# Altium project KN_ATx32.PrjPcb
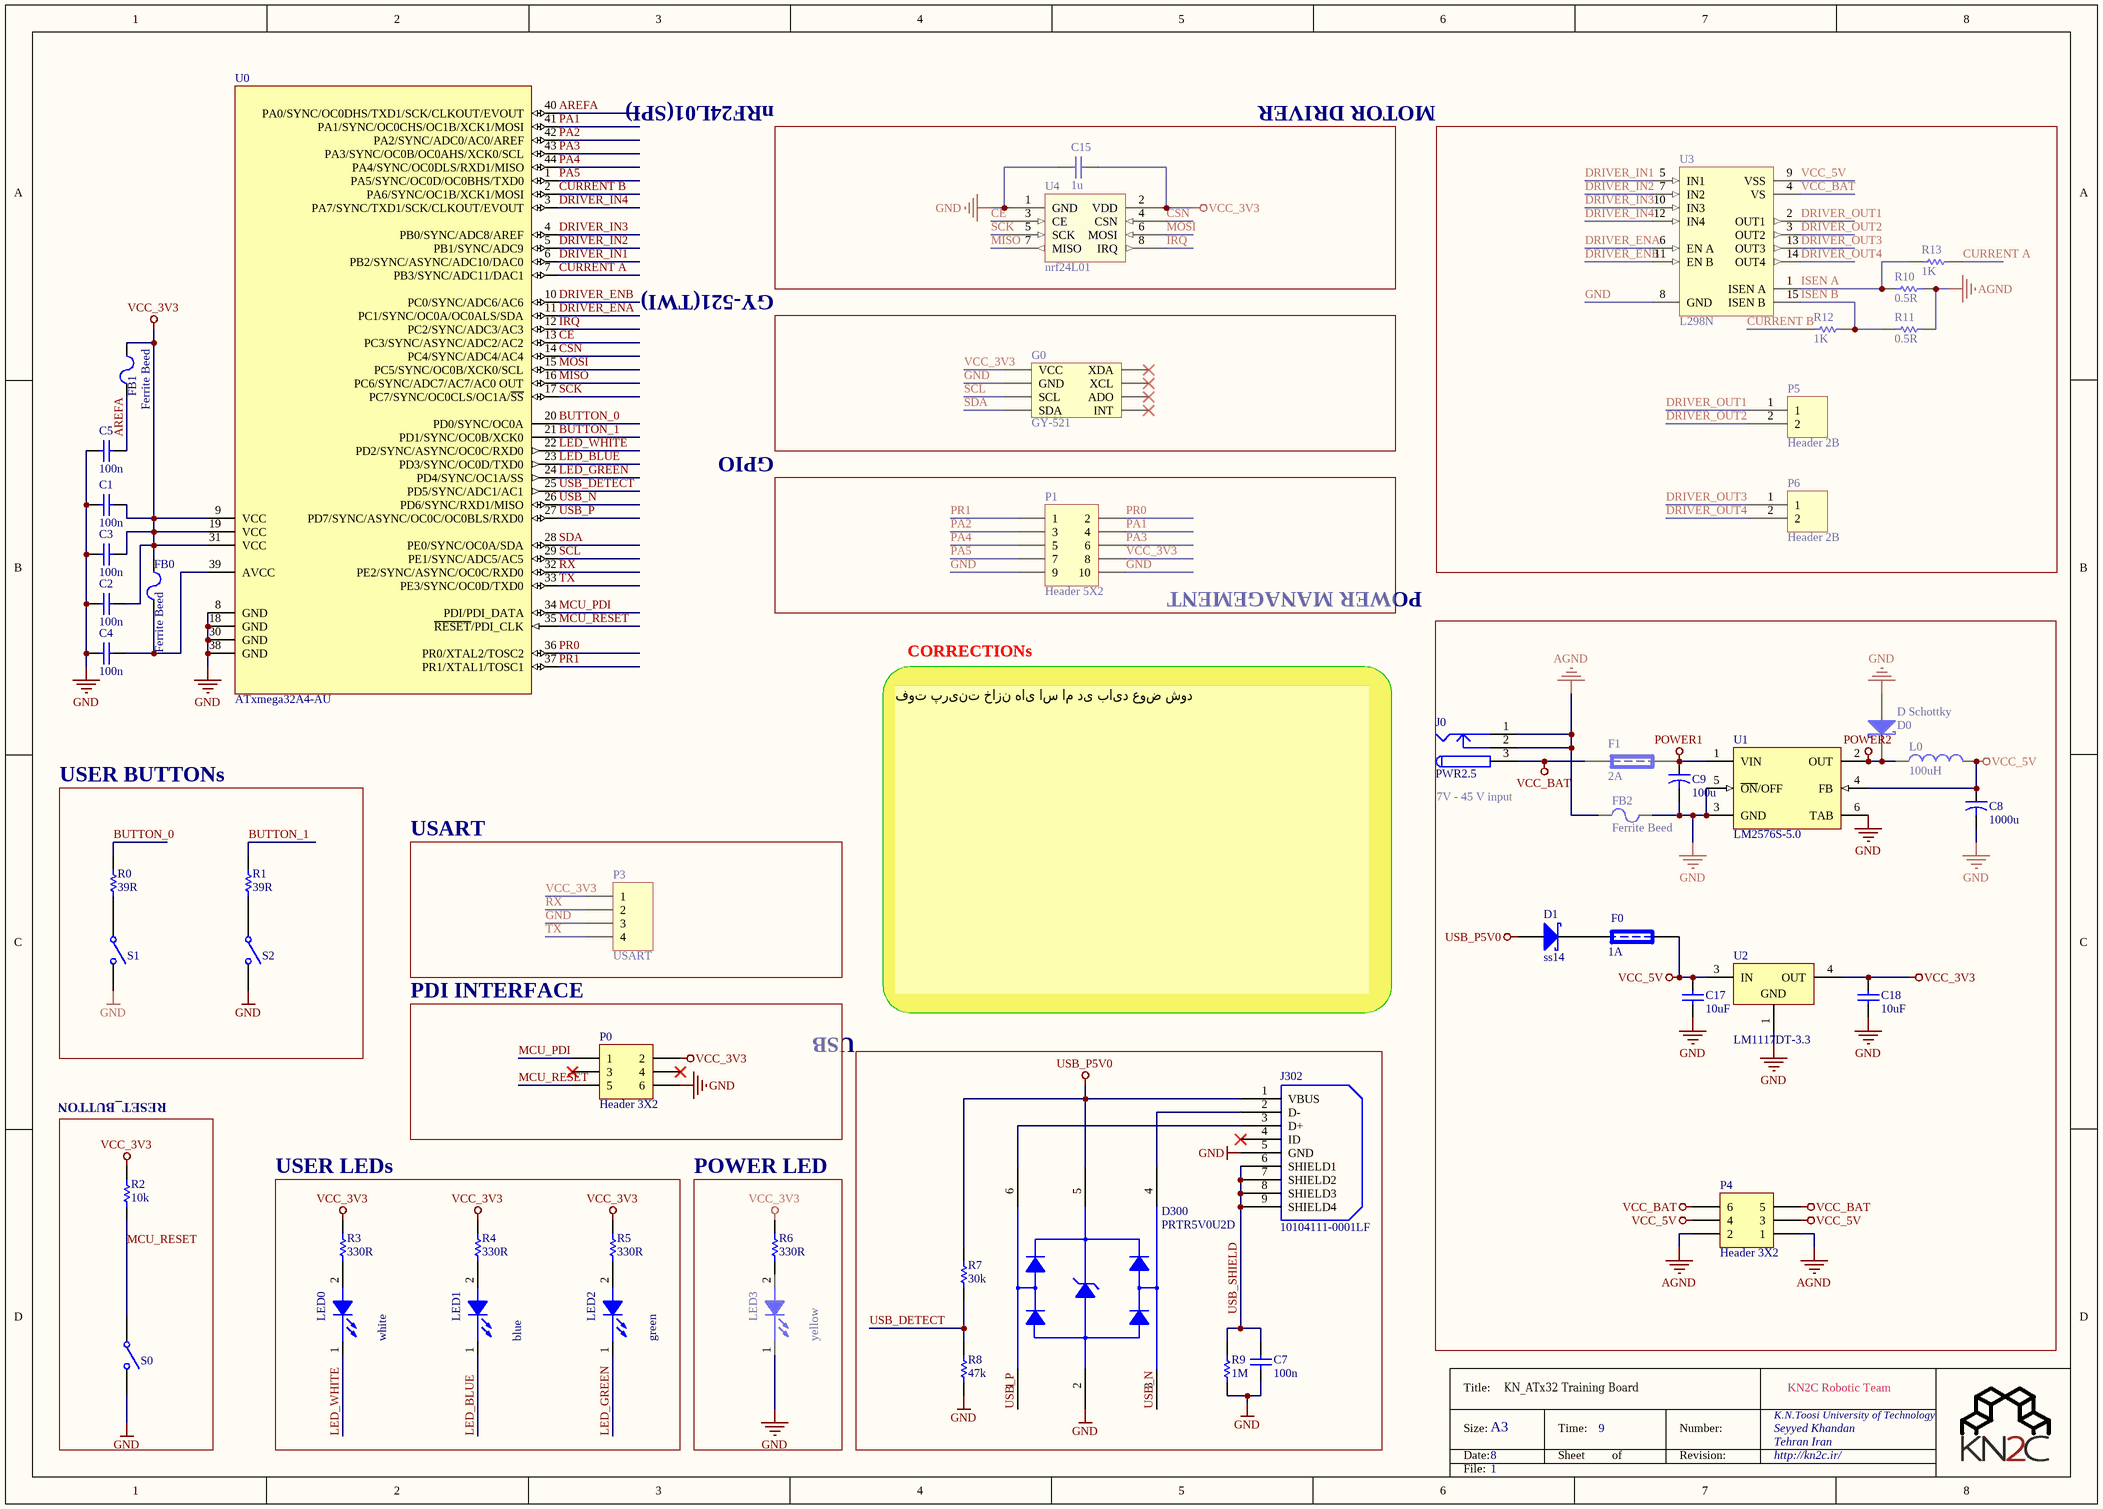
[diagram p0: KN_ATx32.SchDoc]
1 sheet, 55 parts. Net scope: global (net labels, ports and power ports of the same name join across sheets).
Board file: KN_ATx32.PcbDoc

## Sheet KN_ATx32.SchDoc: KN_ATx32 Training ‌Board
size A3; Date: 0; ApprovedBy: 6; CheckedBy: 7; Author: KN2C Robotic Team (M.A.K); CompanyName: KN2C Robotic Team; DrawnBy: 4; Engineer: 5; Organization: 7; Address1: K.N.Toosi University of Technology; Address2: Seyyed Khandan; Address3: Tehran Iran; Address4: http://kn2c.ir/; DocumentNumber: 1; Revision: 1.0; SheetNumber: 1; SheetTotal: 1; CurrentTime: 9; CurrentDate: 8; Time: 8; DocumentFullPathAndName: 1; DocumentName: 2; ModifiedDate: 6; ProjectName: 8; Application_BuildNumber: 5

### Parts
C1  100n  [6-0805_N]
C2  100n  [6-0805_N]
C3  100n  [6-0805_N]
C4  100n  [6-0805_N]
C5  100n  [6-0805_N]
C7  100n  [6-0805_N]
C8  1000u  [AP1-00122]
C9  100u  [AP1-00122]
C15  1u  [6-0805_N]
C17  10uF  [2012[0805]]
C18  10uF  [2012[0805]]
D0  D Schottky  [us1m]
D1  ss14  [US1m]
D300  value PRTR5V0U2D  [SOT457_N]  (hidden comment: PRTR5V0U2X)
F0  1A  [1206]
F1  2A  [1206]
FB0  Ferrite Beed  [2012[0805]]
FB1  Ferrite Beed  [2012[0805]]
FB2  Ferrite Beed  [AXIAL-0.3]
G0  GY-521  [GY-521]
J0  PWR2.5  [CHARGER2]
J302  value 10104111-0001LF  [AP8-00852]  (hidden comment: USB_AB)
L0  100uH  [INDUCTOR_SMD]
LED0  white  [6-0805_N]
LED1  blue  [6-0805_N]
LED2  green  [6-0805_N]
LED3  yellow  [6-0805_N]
P0  Header 3X2  [HDRBOX2X3]
P1  Header 5X2  [HDR2X5]
P3  USART  [HDR1X4]
P4  Header 3X2  [HDR2X3]
P5  Header 2B  [CON2]
P6  Header 2B  [CON2]
R0  39R  [2012[0805]]
R1  39R  [2012[0805]]
R2  10k  [2012[0805]]
R3  330R  [2012[0805]]
R4  330R  [2012[0805]]
R5  330R  [2012[0805]]
R6  330R  [2012[0805]]
R7  30k  [2012[0805]]
R8  47k  [2012[0805]]
R9  1M  [2012[0805]]
R10  0.5R  [6332[2512]]
R11  0.5R  [6332[2512]]
R12  1K  [2012[0805]]
R13  1K  [2012[0805]]
S0  SW-SPST  [pushbutton_smd]  (value not drawn)
S1  SW-SPST  [pushbutton_smd]  (value not drawn)
S2  SW-SPST  [pushbutton_smd]  (value not drawn)
U0  ATxmega32A4-AU  [44A_N]
U1  LM2576S-5.0  [TS5B_N]
U2  LM1117DT-3.3  [SOT223]
U3  L298N  [Multiwatt15V]
U4  nrf24L01  [NRF24L01]

### Blocks framed on the sheet
GY-521(TWI): C15 U4
GPIO: G0
7V - 45 V input: C8 C9 C17 C18 D0 D1 F0 F1 FB2 J0 L0 P4 U1 U2
USER BUTTONs: R0 R1 S1 S2
USART: P3
PDI INTERFACE: P0
USER LEDs: LED0-LED2 R3-R5
POWER LED: LED3 R6

### Nets
AGND: FB2.2 J0.1 J0.2 P4.1 P4.2 R10.2 R11.2
GND: C1.1 C2.1 C3.1 C4.1 C5.1 C7.1 C8.2 C9.2 C15.1 C17.1 C18.1 D0.1(A) D300.2(GND) FB2.1 G0.2(GND) J302.5(GND) LED3.1(CATHODE) P0.6 P1.9 P1.10 P3.3 R8.1 R9.1 S0.2(NO) S1.2(NO) S2.2(NO) U0.8(GND) U0.18(GND) U0.30(GND) U0.38(GND) U1.3(GND) U1.5(~{ON}/OFF) U1.6(TAB) U2.1(GND) U3.8(GND) U4.1(GND)
POWER1: C9.1 F1.2 U1.1(VIN)
POWER2: D0.2(K) L0.1 U1.2(OUT)
USB_P5V0: D1.1(A) D300.5(VCC) J302.1(VBUS) R7.2
VCC_3V3: C1.2 C2.2 C3.2 C15.2 C18.2 FB0.2 FB1.2 G0.1(VCC) P0.2 P1.8 P3.1 R2.2 R3.2 R4.2 R5.2 R6.2 U0.9(VCC) U0.19(VCC) U0.31(VCC) U2.4(OUT) U4.2(VDD)
VCC_5V: C8.1 C17.2 F0.1 L0.2 P4.3 P4.4 U1.4(FB) U2.3(IN) U3.9(VSS)
VCC_BAT: F1.1 J0.3 P4.5 P4.6 U3.4(VS)
AREFA: C5.2 FB1.1 U0.40(PA0/SYNC/OC0DHS/TXD1/SCK/CLKOUT/EVOUT)
BUTTON_0: R0.2 U0.20(PD0/SYNC/OC0A)
BUTTON_1: R1.2 U0.21(PD1/SYNC/OC0B/XCK0)
CE: U0.13(PC3/SYNC/ASYNC/ADC2/AC2) U4.3(CE)
CSN: U0.14(PC4/SYNC/ADC4/AC4) U4.4(CSN)
CURRENT A: R13.2 U0.7(PB3/SYNC/ADC11/DAC1)
CURRENT B: R12.1 U0.2(PA6/SYNC/OC1B/XCK1/MOSI)
DRIVER_ENA: U0.11(PC1/SYNC/OC0A/OC0ALS/SDA) U3.6(EN_A)
DRIVER_ENB: U0.10(PC0/SYNC/ADC6/AC6) U3.11(EN_B)
DRIVER_IN1: U0.6(PB2/SYNC/ASYNC/ADC10/DAC0) U3.5(IN1)
DRIVER_IN2: U0.5(PB1/SYNC/ADC9) U3.7(IN2)
DRIVER_IN3: U0.4(PB0/SYNC/ADC8/AREF) U3.10(IN3)
DRIVER_IN4: U0.3(PA7/SYNC/TXD1/SCK/CLKOUT/EVOUT) U3.12(IN4)
DRIVER_OUT1: P5.1 U3.2(OUT1)
DRIVER_OUT2: P5.2 U3.3(OUT2)
DRIVER_OUT3: P6.1 U3.13(OUT3)
DRIVER_OUT4: P6.2 U3.14(OUT4)
IRQ: U0.12(PC2/SYNC/ADC3/AC3) U4.8(IRQ)
ISEN A: R10.1 R13.1 U3.1(ISEN_A)
ISEN B: R11.1 R12.2 U3.15(ISEN_B)
LED_BLUE: LED1.1(CATHODE) U0.23(PD3/SYNC/OC0D/TXD0)
LED_GREEN: LED2.1(CATHODE) U0.24(PD4/SYNC/OC1A/SS)
LED_WHITE: LED0.1(CATHODE) U0.22(PD2/SYNC/ASYNC/OC0C/RXD0)
MCU_PDI: P0.1 U0.34(PDI/PDI_DATA)
MCU_RESET: P0.5 R2.1 S0.1(COMMON) U0.35(~{RESET}/PDI_CLK)
MISO: U0.16(PC6/SYNC/ADC7/AC7/AC0_OUT) U4.7(MISO)
MOSI: U0.15(PC5/SYNC/OC0B/XCK0/SCL) U4.6(MOSI)
PA1: P1.4 U0.41(PA1/SYNC/OC0CHS/OC1B/XCK1/MOSI)
PA2: P1.3 U0.42(PA2/SYNC/ADC0/AC0/AREF)
PA3: P1.6 U0.43(PA3/SYNC/OC0B/OC0AHS/XCK0/SCL)
PA4: P1.5 U0.44(PA4/SYNC/OC0DLS/RXD1/MISO)
PA5: P1.7 U0.1(PA5/SYNC/OC0D/OC0BHS/TXD0)
PR0: P1.2 U0.36(PR0/XTAL2/TOSC2)
PR1: P1.1 U0.37(PR1/XTAL1/TOSC1)
RX: P3.2 U0.32(PE2/SYNC/ASYNC/OC0C/RXD0)
SCK: U0.17(PC7/SYNC/OC0CLS/OC1A/~{SS}) U4.5(SCK)
SCL: G0.3(SCL) U0.29(PE1/SYNC/ADC5/AC5)
SDA: G0.4(SDA) U0.28(PE0/SYNC/OC0A/SDA)
TX: P3.4 U0.33(PE3/SYNC/OC0D/TXD0)
USB_DETECT: R7.1 R8.2 U0.25(PD5/SYNC/ADC1/AC1)
USB_N: D300.3(I/O2) U0.26(PD6/SYNC/RXD1/MISO)
USB_P: D300.1(I/O_1) U0.27(PD7/SYNC/ASYNC/OC0C/OC0BLS/RXD0)
USB_SHIELD: C7.2 J302.6(SHIELD1) J302.7(SHIELD2) J302.8(SHIELD3) J302.9(SHIELD4) R9.2
NetC4_2: C4.2 FB0.1 U0.39(AVCC)
NetD1_2: D1.2(K) F0.2
NetD300_4: D300.4(I/O2) J302.2(D-)
NetD300_6: D300.6(I/O1) J302.3(D+)
NetLED0_2: LED0.2(ANODE) R3.1
NetLED1_2: LED1.2(ANODE) R4.1
NetLED2_2: LED2.2(ANODE) R5.1
NetLED3_2: LED3.2(ANODE) R6.1
NetR0_1: R0.1 S1.1(COMMON)
NetR1_1: R1.1 S2.1(COMMON)

Not connected (* = marked no-connect by the designer): G0 5(XDA)* 6(XCL)* 7(ADO)* 8(INT)*; J302 4(ID)*; P0 3* 4*

### Notes on the sheet
- nRF24L01(SPI)
- MOTOR DRIVER
- POWER MANAGEMENT
- CORRECTIONs
- فوت پرینت خازن های اس ام دی باید عوض شود
- USB
- RESET_BUTTON
- Title:
- Size:
- Date:
- A3
- Sheet
- Time:
- of
- Number:
- Revision:
- File:

### Library data of the parts
C1-C5 C7 C15 = Cap: Capacitor; Published: 8-Jun-2000; LatestRevisionDate: 17-Jul-2002; LatestRevisionNote: Re-released for DXP Platform.; PackageReference: RAD-0.3; Publisher: Altium Limited; PackageDescription: Radial Cap, Thru-Hole; 2 Leads; 0.3 in Pin Spacing
  C1-C5 C7: Value: 100n
  C15: Value: 1u
C8 C9 = Cap_El_200V: Capacitor; Published: 23-Sep-2002; PackageReference: CAPR5-4X5; Publisher: Altium Limited
  C8: Value: 1000u
  C9: Value: 100u
C17 C18 = Cap_UP: Capacitor; Published: 8-Jun-2000; LatestRevisionDate: 17-Jul-2002; LatestRevisionNote: Re-released for DXP Platform.; PackageReference: RAD-0.3; Publisher: Altium Limited; Value: 10uF
D0 D1 = D Schottky: Schottky Diode; Published: 8-Jun-2000; LatestRevisionDate: 17-Jul-2002; LatestRevisionNote: Re-released for DXP Platform.; PackageReference: SMB; Publisher: Altium Limited; PackageDescription: DO-214-AA/SMB; 2 C-Bend Leads; Body 5.3 x 3.6 mm, inc. leads (LxW); Code_JEDEC: DO-214-AA
D300 = PRTR5V0U2D: Double rail-to-rail USB ESD protection diode; OrcadPartType: Integrated Circuits&Special function&Protection; Manufacturer: Philips; AN: A06-0236; TemperatureRange: -40 to +85 C; PartType: Buy; Height: 1,10000002384186; MPN: PRTR5V0U2X
F0 F1 = Fuse: Published: 8-Jun-2000; LatestRevisionDate: 17-Jul-2002; LatestRevisionNote: Re-released for DXP Platform.; PackageReference: PIN-W2/E2.8; Publisher: Altium Limited
  F0: value: 1A
  F1: value: 2A
FB0-FB2 = Ferrite Beed: Code_IEC: 1005; Published: 8-Jun-2000; LatestRevisionDate: 17-Jul-2002; LatestRevisionNote: Re-released for DXP Platform.; PackageReference: 0402-A; Publisher: Altium Limited; Code_JEITA: 0402
J0 = PWR2.5: Low Voltage Power Supply Connector; Published: 17-Dec-2003; DatasheetDocument: 09-May-2002; Publisher: Altium Limited; ComponentLink1Description: Manufacturer Link; ComponentLink1URL: http://domino.kycon.com/internet/Products.html
J302 = USB_AB: Micro USB AB Connector; PartGroup: Mechanical devices,Connectors,USB; Manufacturer: FCI; AN: A08-1368; Height: 2.59999990463257; MPN: 10104111-0001LF
L0 = Inductor: Code_IEC: 1005; Published: 8-Jun-2000; LatestRevisionDate: 17-Jul-2002; LatestRevisionNote: Re-released for DXP Platform.; PackageReference: 0402-A; Publisher: Altium Limited; Code_JEITA: 0402; Value: 100uH
LED0-LED3 = A10-0019: LED, Yellow, Wave length=591nm, SMD 0805, ±70°; PartGroup: Opto,LEDs,SMD; Manufacturer: Everlight; MPN: 17-21UYC/S530-A3/TR8; Value: EL17-21UYC/A2; TemperatureRange: -40 to +85 deg C; AN: A10-0019; Height: 1,10000002384186
P0 P4 = Header 3X2: Header, 3-Pin, Dual row; LatestRevisionDate: 17-Jul-2002; LatestRevisionNote: Re-released for DXP Platform.; Publisher: Altium Limited
P1 = Header 5X2: Header, 5-Pin, Dual row; LatestRevisionDate: 17-Jul-2002; LatestRevisionNote: Re-released for DXP Platform.; Publisher: Altium Limited
P3 = Header 4: Header, 4-Pin; LatestRevisionDate: 17-Jul-2002; LatestRevisionNote: Re-released for DXP Platform.; Publisher: Altium Limited
R0-R13 = Res: Semiconductor Resistor; Published: 8-Jun-2000; LatestRevisionDate: 17-Jul-2002; LatestRevisionNote: Re-released for DXP Platform.; PackageReference: AXIAL-0.5; Publisher: Altium Limited
  R0 R1: Value: 39R
  R2: Value: 10k
  R3-R6: Value: 330R
  R7: Value: 30k
  R8: Value: 47k
  R9: Value: 1M
  R10 R11: Value: 0.5R
  R12 R13: Value: 1K
S0-S2 = SW-SPST: Single-Pole, Single-Throw Switch; Published: 24-Mar-1999; Revision: July-2002: Re-released for DXP Platform.; Publisher: Altium Limited
U0 = ATxmega32A4-AU: 8/16-bit AVR XMEGA A4 Microcontroller, 1.6-3.6V, 32KB + 4KB Flash, 1KB EEPROM, 4KB SRAM, 44-pin TQFP, Industrial Grade (-40°C to 85°C), Pb-Free; Published: 1-Apr-2010; DatasheetVersion: revN, Feb-2010; PackageVersion: rev.B, Oct-2001; PackageReference: 44A; Publisher: Altium Limited; PackageDescription: 44-Pin Plastic Thin Profile Quad Flat Pack, 10 x 10 x 1.0 mm Body, 0.8 mm Pitch (TQFP); Supplier 1: Digi-Key; Supplier Part Number 1: ATXMEGA32A4-AU-ND; Supplier 2: Farnell; Supplier Part Number 2: 1748557; Supplier 3: Mouser; Supplier Part Number 3: 556-ATXMEGA32A4-AU; ComponentLink1Description: Manufacturer Link; ComponentLink1URL: http://www.atmel.com/products/avr/default.asp?; ComponentLink2Description: ATxmega16A4/32A4/64A4/128A4 Datasheet; ComponentLink2URL: http://www.atmel.com/dyn/resources/prod_documents/doc8069.pdf; ComponentLink3Description: Atmel.com Home; ComponentLink3URL: http://www.atmel.com
U1 = LM2576S-5.0: SIMPLE SWITCHER® 3A Step-Down Voltage Regulator, 5-pin TO-263; Manufacturer: National Semiconductor; PackageTopMarking: NSUZXYTTE#*LM2576S*-5.0 P+; PowerWise: N; Published: 4-Dec-2008; DatasheetVersion: Aug-2004; PackageVersion: revD, Apr-2005; PackageReference: TS5B; Publisher: Altium Limited; PackageDescription: TO-263, Molded, .400 x .390 x .180in, 5 Lead, .067in Pitch, Surface Mount; PartNumber: LM2576S-5.0; RoHS: N; PinCount: 5; CompType: Switcher; Code_JEDEC: MO-169-AB; ComponentLink1Description: LM2576 Datasheet; ComponentLink1URL: http://www.national.com/ds/LM/LM2576.pdf; ComponentLink2Description: LM2576 Web Page; ComponentLink2URL: http://www.national.com/pf/LM/LM2576.html; ComponentLink3Description: TS5B Package Page; ComponentLink3URL: http://www.national.com/packaging/folders/ts5b.html
U2 = LM1117DT-3.3: 800mA Low-Dropout Linear Regulator, 3-pin TO-252; Manufacturer: National Semiconductor; PackageTopMarking: NSUZXYTT*LM1117*DT-3.3; PowerWise: N; CompType: LDO IC; Published: 4-Dec-2008; DatasheetVersion: Apr-2006; PackageVersion: revD, Feb-2009; PackageReference: TD03B; Publisher: Altium Limited; PackageDescription: TO252, Molded, Jedec, 6.8 x 6.10 x 2.30mm Body, 3 Lead, 2.28mm Pitch, Surface Mount; Supplier 1: Farnell; Supplier Part Number 1: 9486275; Supplier 2: Farnell; Supplier Part Number 2: 1523829; PartNumber: LM1117DT-3.3; RoHS: N; PinCount: 3; Code_JEDEC: TO-252-AA; ComponentLink1Description: LM1117 Datasheet; ComponentLink1URL: http://www.national.com/ds/LM/LM1117.pdf; ComponentLink2Description: LM1117 Web Page; ComponentLink2URL: http://www.national.com/pf/LM/LM1117.html; ComponentLink3Description: TD03B Package Page; ComponentLink3URL: http://www.national.com/packaging/folders/td03b.html
U3 = L298N: Dual Full Bridge Driver; Published: 8-Jun-2000; LatestRevisionDate: 14-May-2007; LatestRevisionNote: Mapped to vertical PCB.; DatasheetVersion: Jul-1999; PackageReference: Multiwatt15V; Publisher: Altium Limited; PackageDescription: TO, Thru-Hole, Vertical, Heatsink Mounted; 15 Bent Staggered Leads; Pitch 1.27 mm; ComponentLink1Description: Manufacturer Link; ComponentLink1URL: http://www.st.com/; ComponentLink2Description: Datasheet; ComponentLink2URL: http://www.st.com/stonline/products/literature/ds/1773/l298.pdf